# Altium schematic sheet RF.SchDoc
size A
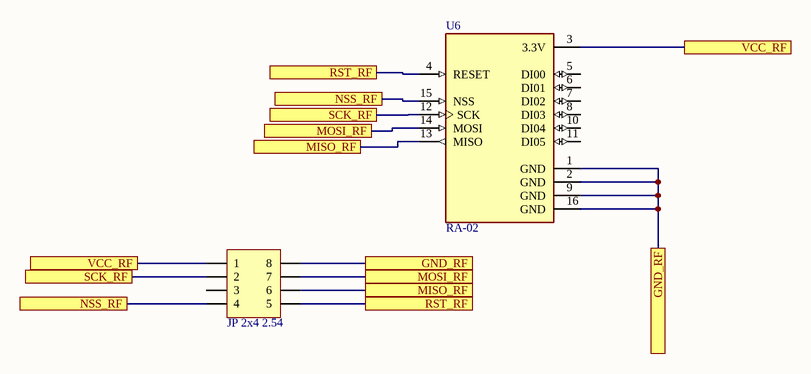
[diagram p0: RF.SchDoc]

## Parts
JP1  JP 2x4 2.54  [JP 2x4 CT]
U6  RA-02  [RA-02]

## Ports
GND_RF, MISO_RF, MOSI_RF, NSS_RF, RST_RF, SCK_RF, VCC_RF

## Nets
GND_RF: JP1.8 U6.1(GND) U6.2(GND) U6.9(GND) U6.16(GND) ; port GND_RF
MISO_RF: JP1.6 U6.13(MISO) ; port MISO_RF
MOSI_RF: JP1.7 U6.14(MOSI) ; port MOSI_RF
NSS_RF: JP1.4 U6.15(NSS) ; port NSS_RF
RST_RF: JP1.5 U6.4(RESET) ; port RST_RF
SCK_RF: JP1.2 U6.12(SCK) ; port SCK_RF
VCC_RF: JP1.1 U6.3(3.3V) ; port VCC_RF

Not connected (* = marked no-connect by the designer): JP1 3; U6 5(DI00) 6(DI01) 7(DI02) 8(DI03) 10(DI04) 11(DI05)

## Library data of the parts
JP1 = JP 2x4 2.54 Cai Thang: Cắm; Ten_Linh_Kien: Jump Đôi Cái 2.54MM 2x20P Thẳng; Don_Vi: Con; Ma_Hang: MH008647; Ghi_Chu: *; Kieu_Chan: *; Chung_Loai: Cắm
U6 = RA-02: General ISM < 1GHz LoRaâ„¢ Transceiver Module 410MHz ~ 525MHz Antenna Not Included, I-PEX Surface Mount; MF: Ai-Thinker; Package: None; Price: None; Value: *; SnapEDA_Link: https://www.snapeda.com/parts/RA-02/AI-Thinker/view-part/?ref=snap; MP: RA-02; Availability: Not in stock; Check_prices: https://www.snapeda.com/parts/RA-02/AI-Thinker/view-part/?ref=eda